# Altium schematic sheet MLX90393SLW.SchDoc
size A; SheetNumber: 1; SheetTotal: 1
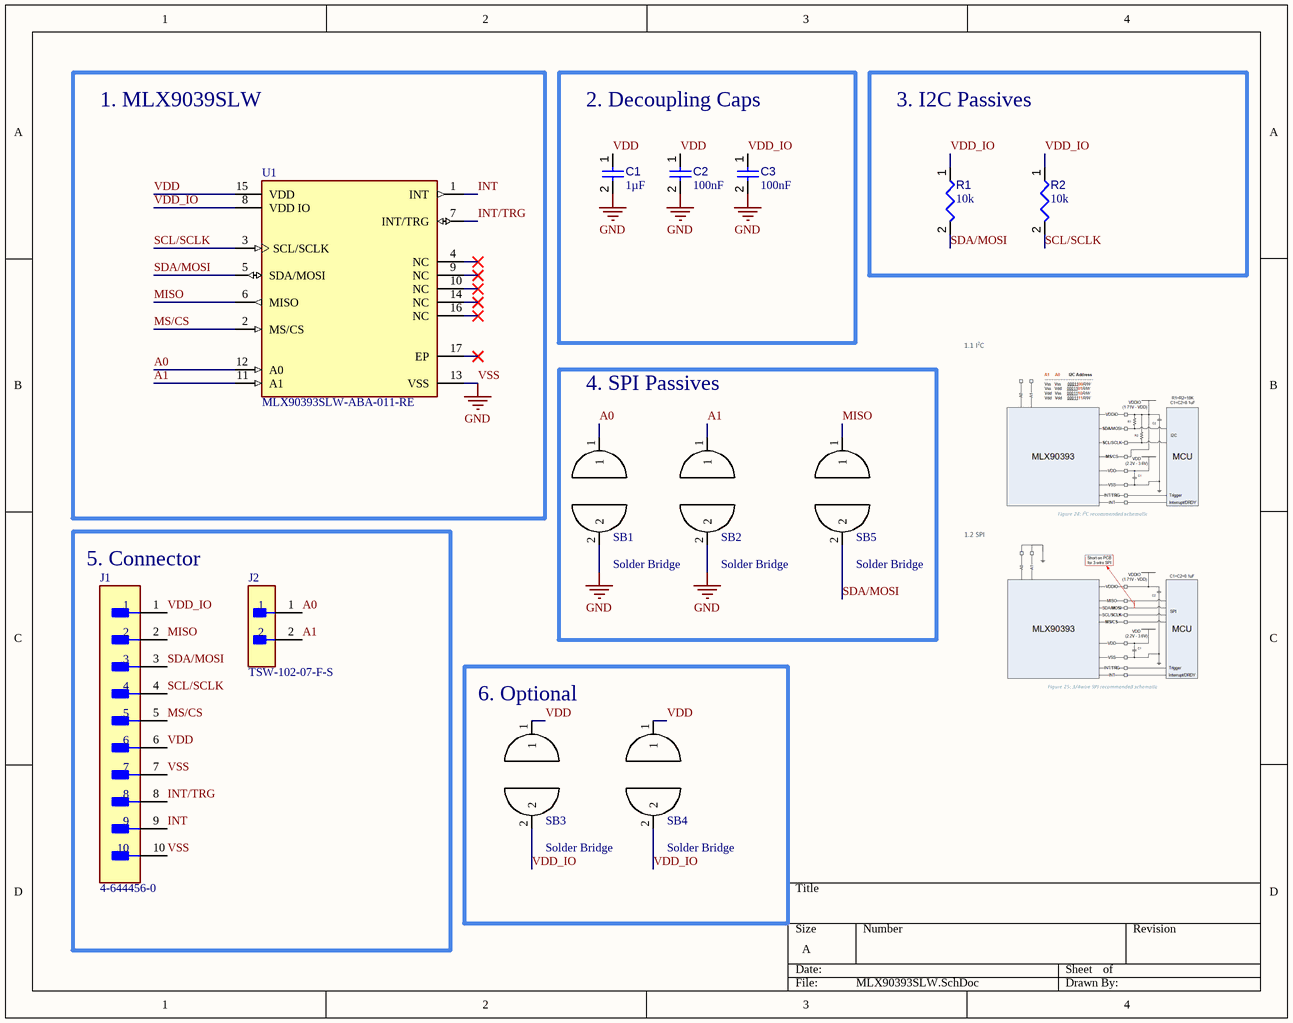
[diagram p0: MLX90393SLW.SchDoc]

## Parts
C1  value 1µF  [CAPC0402(1005)60_L]  (hidden comment: Capacitor 1µF +/-20% 10V 0402)
C2  value 100nF  [CAPC0402(1005)60_L]  (hidden comment: Capacitor 100nF +/-20% 25V 0402)
C3  value 100nF  [CAPC0402(1005)60_L]  (hidden comment: Capacitor 100nF +/-20% 25V 0402)
J1  4-644456-0  [FP-4-644456-0-MFG]
J2  TSW-102-07-F-S  [FP-TSW-102-07-F-S-MFG]
R1  value 10k  [RESC1608X55X25ML10T15]  (hidden comment: Resistor 10k +/-1% 0603 100 mW)
R2  value 10k  [RESC1608X55X25ML10T15]  (hidden comment: Resistor 10k +/-1% 0603 100 mW)
SB1  Solder Bridge  [Solder Bridge-Footprint-1]
SB2  Solder Bridge  [Solder Bridge-Footprint-1]
SB3  Solder Bridge  [Solder Bridge-Footprint-1]
SB4  Solder Bridge  [Solder Bridge-Footprint-1]
SB5  Solder Bridge  [Solder Bridge-Footprint-1]
U1  MLX90393SLW-ABA-011-RE  [FP-MLX90393SLW-ABA-011-RE-IPC_B]

## Blocks framed on the sheet
1. MLX9039SLW: U1
2. Decoupling Caps: C1-C3
3. I2C Passives: R1 R2
4. SPI Passives: SB1 SB2 SB5
5. Connector: J1 J2
6. Optional: SB3 SB4

## Nets
VSS: C1.2 C2.2 C3.2 J1.7 J1.10 SB1.2 SB2.2 U1.13(VSS)  [also labelled GND]
A0: J2.1 SB1.1 U1.12(A0)
A1: J2.2 SB2.1 U1.11(A1)
INT: J1.9 U1.1(INT)
INT/TRG: J1.8 U1.7(INT/TRG)
MISO: J1.2 SB5.1 U1.6(MISO)
MS/CS: J1.5 U1.2(MS/CS)
SCL/SCLK: J1.4 R2.2 U1.3(SCL/SCLK)
SDA/MOSI: J1.3 R1.2 SB5.2 U1.5(SDA/MOSI)
VDD: C1.1 C2.1 J1.6 SB3.1 SB4.1 U1.15(VDD)
VDD_IO: C3.1 J1.1 R1.1 R2.1 SB3.2 SB4.2 U1.8(VDD_IO)

Not connected (* = marked no-connect by the designer): U1 4(NC)* 9(NC)* 10(NC)* 14(NC)* 16(NC)* 17(EP)*

## Library data of the parts
C1 = CMP-001-00063-3: Chip Capacitor, 1µF +/-20%, 10V, 0402, Thickness 0.6 mm; Tolerance: 10%; Mounting Technology: SMT; Max Operating Temperature: 85°C; Voltage Rating: 10V; Pins: 2; Case/Package: 0402; Min Operating Temperature: -55°C
C2 C3 = CMP-001-00065-4: Chip Capacitor, 100nF +/-20%, 25V, 0402, Thickness 0.6 mm; Tolerance: 10%; Max Operating Temperature: 85°C; Min Operating Temperature: -55°C; Pins: 2; Voltage Rating: 25V; Mounting Technology: SMT; Case/Package: 0402
J1 = CMP-002-00078-1: Conn Unshrouded Header HDR 10 POS 2.54mm Solder ST Top Entry Thru-Hole Bag/Box; Shrouded: No (Without); Voltage Rating (AC): 250V; Contact Resistance: 6mR; PCB Mounting Orientation: Vertical; Number of Positions: 10; PCB Thickness: 0.063inch; Gender: Male; Circuit Application: Signal; Contact Current Rating: 5A; Plating: Tin; Connector System: Wire-to-Board; Tail Length: 0.11inch; Contact Style: Straight; PCB Mount Retention: Without; Plating Thickness: 1.27um; Approvals: CSA; Underplate Material: Nickel; Connector Type: Plug,Header,Pin; Contact Gender: Male; Series: MTA-100; Depth: 2.33mm; Height: 10.03mm; Length: 25.1mm; Housing Color: Natural; RoHS Compliant: Yes; Packaging: Bag; Flammability Rating: UL94 V-0; Strain Relief: No (Without); Contact Shape: Square; Color: Natural; Radiation Hardening: No; Orientation: Straight; Lead Free: Lead Free; Contact Retention: No (Without); Contact Mating Length: 7.49mm; Termination: Solder; Pitch: 2.54mm; Mating Alignment: No (Without); Min Operating Temperature: -67°C; Current Rating: 5A; Number of Rows: 1; Contact Material: Copper Alloy; Mating Retention: No (Without); ELV: Compliant; Mounting Technology: Through Hole; Housing Material: Polyester; Contact Plating: Tin,Matte; Package Quantity: 500; Max Voltage Rating (AC): 250V; Operating Supply Voltage: 250V; Contact Type: Male Pin; Number of Contacts: 10; Voltage Rating: 250V; Backwall/Post Interruptions: No (Without); Sealable: No (Without); Max Operating Temperature: 221°C; PCB Mount Alignment: No (Without)
J2 = CMP-002-00073-1: Conn Unshrouded Header HDR 2 POS 2.54mm Solder ST Top Entry Thru-Hole Bag
R1 R2 = CMP-009-00017-5: Chip Resistor, 10 KOhm, +/- 1%, 01 W, -55 to 155 degC, 0603 (1608 Metric); Voltage Rating: 50V; Power: 100mW; RoHS Compliant: True; Min Operating Temperature: -55°C; Pins: 2; Case/Package: 0603; Mounting Technology: SM; Max Operating Temperature: 155°C; Tolerance: 1%
SB1-SB5 = CMP-001-0004-3: Solder Bridge 10mil gap 6mil short
U1 = CMP-001-0003-1: Triaxis® Magnetic node - Micropower Magnetometer ft. SPI/I2C Output - I2C_addres; Output Type: SPI,I2C; Axis: X, Y, Z; Mounting Technology: Surface Mount; RoHS Compliant: Yes; Max Operating Temperature: 85°C; Packaging: Cut Tape; Min Operating Temperature: -20°C; Case/Package: QFN; Series: Automotive, AEC-Q100, Triaxis®